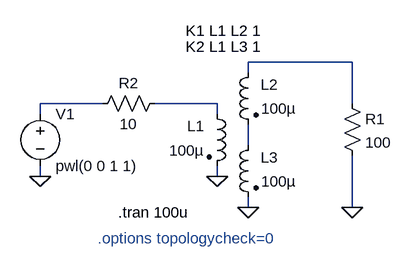
[diagram p0: schematic BadTopo.asc]
BadTopo.asc, the LTspice schematic file:
Version 4
SHEET 1 880 680
WIRE 320 176 160 176
WIRE 160 192 160 176
WIRE -64 240 -160 240
WIRE 112 240 16 240
WIRE 320 240 320 176
WIRE -160 256 -160 240
WIRE 112 256 112 240
WIRE 160 304 160 272
WIRE -160 352 -160 336
WIRE 112 352 112 336
WIRE 160 400 160 384
WIRE 320 400 320 320
FLAG -160 352 0
FLAG 112 352 0
FLAG 320 400 0
FLAG 160 400 0
SYMBOL ind2 96 240 R0
WINDOW 0 -3 35 Right 0
WINDOW 3 -4 72 Right 0
SYMATTR InstName L1
SYMATTR Value 100µ
SYMATTR Type ind
SYMBOL ind2 176 176 M0
WINDOW 0 -3 35 Right 0
WINDOW 3 -4 72 Right 0
SYMATTR InstName L2
SYMATTR Value 100µ
SYMATTR Type ind
SYMBOL ind2 176 288 M0
WINDOW 0 -3 35 Right 0
WINDOW 3 -4 72 Right 0
SYMATTR InstName L3
SYMATTR Value 100µ
SYMATTR Type ind
SYMBOL res 304 224 R0
SYMATTR InstName R1
SYMATTR Value 100
SYMBOL voltage -160 240 R0
SYMATTR InstName V1
SYMATTR Value pwl(0 0 1 1)
SYMBOL res 32 224 R90
WINDOW 0 0 56 VBottom 0
WINDOW 3 32 56 VTop 0
SYMATTR InstName R2
SYMATTR Value 10
TEXT -40 408 Left 0 !.tran 100u
TEXT 64 128 Left 0 !K1 L1 L2 1
TEXT 64 152 Left 0 !K2 L1 L3 1
TEXT -72 448 Left 0 ;.options topologycheck=0

The netlist it stands for:
* BadTopo.asc
L1 N003 0 100µ
L2 N001 N004 100µ
L3 N004 0 100µ
R1 N001 0 100
V1 N002 0 pwl(0 0 1 1)
R2 N003 N002 10
.tran 100u
K1 L1 L2 1
K2 L1 L3 1
* .options topologycheck=0
.backanno
.end